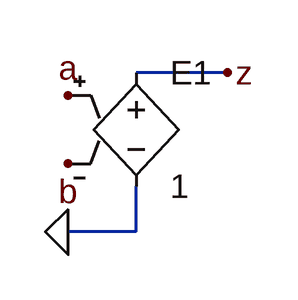
[diagram p0: schematic sub.asc]
sub.asc, the LTspice schematic file:
Version 4
SHEET 1 880 680
WIRE 304 112 240 112
WIRE 240 224 240 192
WIRE 240 224 192 224
FLAG 192 128 a
FLAG 192 224 0
FLAG 304 112 z
FLAG 192 176 b
SYMBOL e 240 96 R0
SYMATTR InstName E1
SYMATTR Value 1

The netlist it stands for:
* sub.asc
E1 z 0 a b 1
.backanno
.end